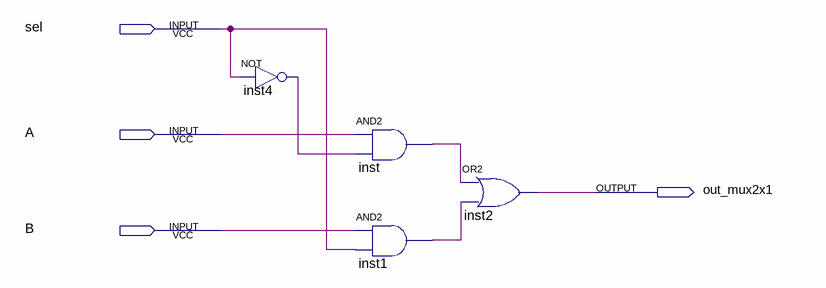
[diagram p0: schematic sheet]
// Quartus schematic mux_2x1.bdf as structural Verilog: 4 symbols, 4 pins
module mux_2x1 (
  input  sel,
  input  A,
  input  B,
  output out_mux2x1
);

  wire inst1_out, inst4_out, inst_out;

  not inst4 (inst4_out, sel);
  and inst (inst_out, A, inst4_out);
  and inst1 (inst1_out, B, sel);
  or inst2 (out_mux2x1, inst_out, inst1_out);
endmodule
